# EAGLE schematic Noctua (EAGLE 9.2.1)
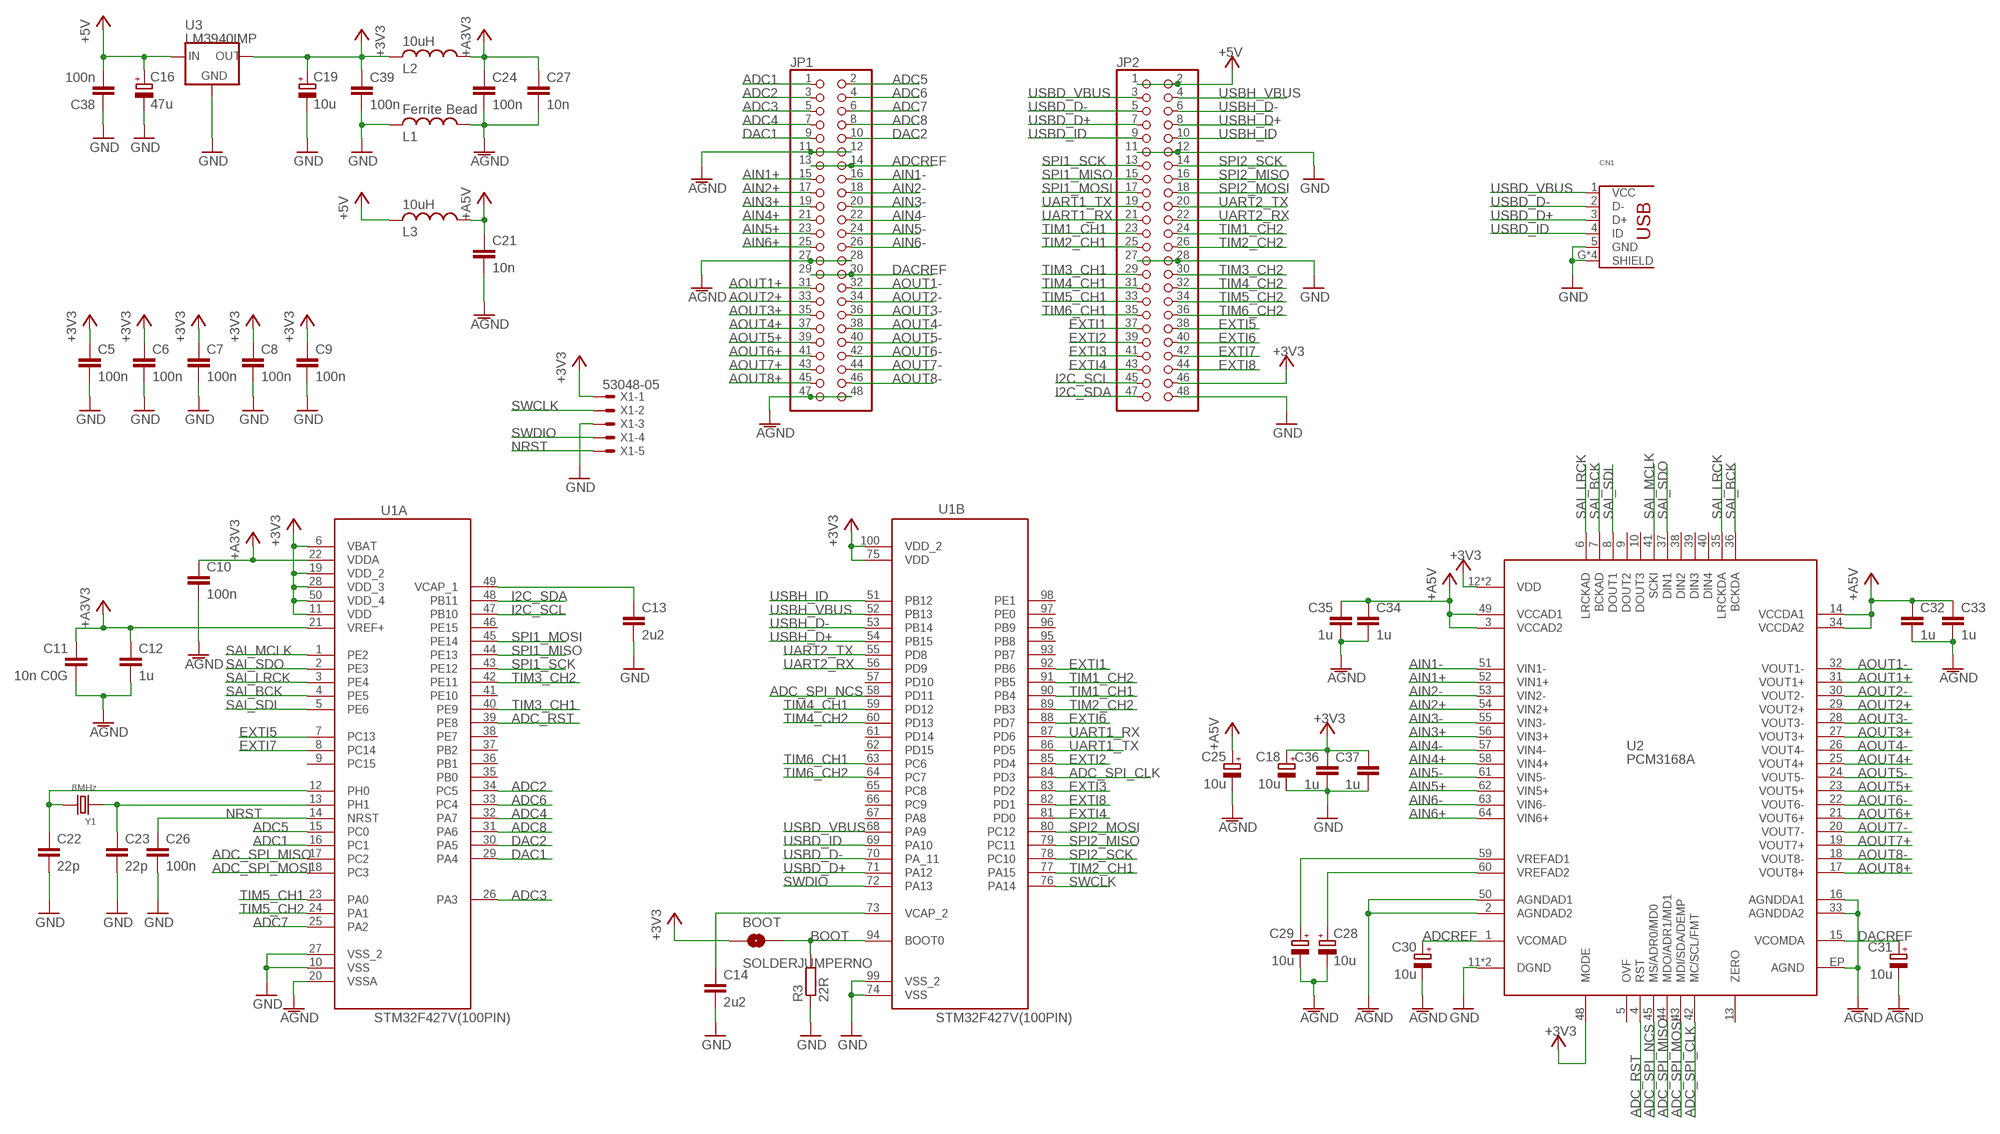
[diagram p0: schematic, sheet 1]

## Parts
BOOT  SOLDERJUMPERNO  [SJ_2S-NO]
C5  100n  C-EUC0603  [C0603]
C6  100n  C-EUC0603  [C0603]
C7  100n  C-EUC0603  [C0603]
C8  100n  C-EUC0603  [C0603]
C9  100n  C-EUC0603  [C0603]
C10  100n  C-EUC0603  [C0603]
C11  10n C0G  C-EUC0603  [C0603]
C12  1u  C-EUC0603  [C0603]
C13  2u2  C-EUC0603  [C0603]
C14  2u2  C-EUC0603  [C0603]
C16  47u  CPOL-EU153CLV-0505  [CPOL-5]
C18  10u  CPOL-EUB  [PANASONIC_B]
C19  10u  CPOL-EUB  [PANASONIC_B]
C21  10n  C-EUC0603  [C0603]
C22  22p  C-EUC0603  [C0603]
C23  22p  C-EUC0603  [C0603]
C24  100n  C-EUC0603  [C0603]
C25  10u  CPOL-EUB  [PANASONIC_B]
C26  100n  C-EUC0603  [C0603]
C27  10n  C-EUC0603  [C0603]
C28  10u  CPOL-EUB  [PANASONIC_B]
C29  10u  CPOL-EUB  [PANASONIC_B]
C30  10u  CPOL-EUB  [PANASONIC_B]
C31  10u  CPOL-EUB  [PANASONIC_B]
C32  1u  C-EUC0603  [C0603]
C33  1u  C-EUC0603  [C0603]
C34  1u  C-EUC0603  [C0603]
C35  1u  C-EUC0603  [C0603]
C36  1u  C-EUC0603  [C0603]
C37  1u  C-EUC0603  [C0603]
C38  100n  C-EUC0603  [C0603]
C39  100n  C-EUC0603  [C0603]
CN1  USB_HRS_ZX62-B-5PA(11)MICRO.B  [HRS_ZX62RD-AB-5P8]
JP1  PINHD-2X24  [2X24]
JP2  PINHD-2X24  [2X24]
L1  Ferrite Bead  INDUCTOR  [0603]
L2  10uH  INDUCTOR  [0603]
L3  10uH  INDUCTOR  [0603]
R3  22R  R-EU_0603  [0603@1]
U1  STM32F427V(100PIN)  STM32F42XV/43XV(100PIN)  [QFP50P1600X1600X160-100N]
U2  PCM3168A  [PQFP64]
U3  LM3940IMP  V_REG_LM3940IMP  [SOT223]
X1  53048-05  [53048-05]
Y1  8MHz  SMD-CRYSTAL-8MHZ-20PF-20PPM(2P-5.0X3.2MM)  [X2-SMD-5.0X3.2X1.3MM]

## Nets
+3V3: BOOT.1 C5.1 C6.1 C7.1 C8.1 C9.1 C18.+ C19.+ C36.1 C37.1 C39.1 JP2.46 L2.2 U1.6(A:VBAT) U1.11(A:VDD) U1.19(A:VDD_2) U1.28(A:VDD_3) U1.50(A:VDD_4) U1.75(B:VDD) U1.100(B:VDD_2) U2.12(VDD) U2.46(VDD) U2.48(MODE) U3.3(OUT) X1.1
+5V: C16.+ C38.2 JP2.1 JP2.2 L3.2 U3.1(IN)
+A3V3: C10.1 C11.1 C12.1 C24.1 C27.1 L2.1 U1.21(A:VREF+) U1.22(A:VDDA)
+A5V: C21.1 C25.+ C32.1 C33.1 C34.1 C35.1 L3.1 U2.3(VCCAD2) U2.14(VCCDA1) U2.34(VCCDA2) U2.49(VCCAD1)
ADC1: JP1.1 U1.16(A:PC1)
ADC2: JP1.3 U1.34(A:PC5)
ADC3: JP1.5 U1.26(A:PA3)
ADC4: JP1.7 U1.32(A:PA7)
ADC5: JP1.2 U1.15(A:PC0)
ADC6: JP1.4 U1.33(A:PC4)
ADC7: JP1.6 U1.25(A:PA2)
ADC8: JP1.8 U1.31(A:PA6)
ADC_RST: U1.39(A:PE8) U2.4(RST)
ADC_SPI_CLK: U1.84(B:PD3) U2.42(MC/SCL/FMT)
ADC_SPI_MISO: U1.17(A:PC2) U2.44(MDO/ADR1/MD1)
ADC_SPI_MOSI: U1.18(A:PC3) U2.43(MDI/SDA/DEMP)
ADC_SPI_NCS: U1.58(B:PD11) U2.45(MS/ADR0/MD0)
ADCREF: C30.+ JP1.13 JP1.14 U2.1(VCOMAD)
AGND: C10.2 C11.2 C12.2 C21.2 C24.2 C25.- C27.2 C28.- C29.- C30.- C31.- C32.2 C33.2 C34.2 C35.2 JP1.11 JP1.12 JP1.27 JP1.28 JP1.47 JP1.48 L1.1 U1.20(A:VSSA) U2.2(AGNDAD2) U2.16(AGNDDA1) U2.33(AGNDDA2) U2.50(AGNDAD1) U2.EP(AGND)
AIN1+: JP1.15 U2.52(VIN1+)
AIN1-: JP1.16 U2.51(VIN1-)
AIN2+: JP1.17 U2.54(VIN2+)
AIN2-: JP1.18 U2.53(VIN2-)
AIN3+: JP1.19 U2.56(VIN3+)
AIN3-: JP1.20 U2.55(VIN3-)
AIN4+: JP1.21 U2.58(VIN4+)
AIN4-: JP1.22 U2.57(VIN4-)
AIN5+: JP1.23 U2.62(VIN5+)
AIN5-: JP1.24 U2.61(VIN5-)
AIN6+: JP1.25 U2.64(VIN6+)
AIN6-: JP1.26 U2.63(VIN6-)
AOUT1+: JP1.31 U2.31(VOUT1+)
AOUT1-: JP1.32 U2.32(VOUT1-)
AOUT2+: JP1.33 U2.29(VOUT2+)
AOUT2-: JP1.34 U2.30(VOUT2-)
AOUT3+: JP1.35 U2.27(VOUT3+)
AOUT3-: JP1.36 U2.28(VOUT3-)
AOUT4+: JP1.37 U2.25(VOUT4+)
AOUT4-: JP1.38 U2.26(VOUT4-)
AOUT5+: JP1.39 U2.23(VOUT5+)
AOUT5-: JP1.40 U2.24(VOUT5-)
AOUT6+: JP1.41 U2.21(VOUT6+)
AOUT6-: JP1.42 U2.22(VOUT6-)
AOUT7+: JP1.43 U2.19(VOUT7+)
AOUT7-: JP1.44 U2.20(VOUT7-)
AOUT8+: JP1.45 U2.17(VOUT8+)
AOUT8-: JP1.46 U2.18(VOUT8-)
BOOT: BOOT.2 R3.2 U1.94(B:BOOT0)
DAC1: JP1.9 U1.29(A:PA4)
DAC2: JP1.10 U1.30(A:PA5)
DACREF: C31.+ JP1.29 JP1.30 U2.15(VCOMDA)
EXTI1: JP2.37 U1.92(B:PB6)
EXTI2: JP2.39 U1.85(B:PD4)
EXTI3: JP2.41 U1.83(B:PD2)
EXTI4: JP2.43 U1.81(B:PD0)
EXTI5: JP2.38 U1.7(A:PC13)
EXTI6: JP2.40 U1.88(B:PD7)
EXTI7: JP2.42 U1.8(A:PC14)
EXTI8: JP2.44 U1.82(B:PD1)
GND: C5.2 C6.2 C7.2 C8.2 C9.2 C13.2 C14.2 C16.- C18.- C19.- C22.2 C23.2 C26.2 C36.2 C37.2 C38.1 C39.2 CN1.5(GND) CN1.G2(SHIELD) CN1.G3(SHIELD) CN1.G4(SHIELD) CN1.G(SHIELD) JP2.11 JP2.12 JP2.27 JP2.28 JP2.48 L1.2 R3.1 U1.10(A:VSS) U1.27(A:VSS_2) U1.74(B:VSS) U1.99(B:VSS_2) U2.11(DGND) U2.47(DGND) U3.2(GND) X1.3
I2C_SCL: JP2.45 U1.47(A:PB10)
I2C_SDA: JP2.47 U1.48(A:PB11)
N$2: C28.+ U2.60(VREFAD2)
N$11: C13.1 U1.49(A:VCAP_1)
N$12: C23.1 U1.13(A:PH1) Y1.1
N$15: C22.1 U1.12(A:PH0) Y1.2
N$17: C14.1 U1.73(B:VCAP_2)
NRST: C26.1 U1.14(A:NRST) X1.5
SAI_BCK: U1.4(A:PE5) U2.7(BCKAD) U2.36(BCKDA)
SAI_LRCK: U1.3(A:PE4) U2.6(LRCKAD) U2.35(LRCKDA)
SAI_MCLK: U1.1(A:PE2) U2.41(SCKI)
SAI_SDI: U1.5(A:PE6) U2.8(DOUT1)
SAI_SDO: U1.2(A:PE3) U2.37(DIN1)
SPI1_MISO: JP2.15 U1.44(A:PE13)
SPI1_MOSI: JP2.17 U1.45(A:PE14)
SPI1_SCK: JP2.13 U1.43(A:PE12)
SPI2_MISO: JP2.16 U1.79(B:PC11)
SPI2_MOSI: JP2.18 U1.80(B:PC12)
SPI2_SCK: JP2.14 U1.78(B:PC10)
SWCLK: U1.76(B:PA14) X1.2
SWDIO: U1.72(B:PA13) X1.4
TIM1_CH1: JP2.23 U1.90(B:PB4)
TIM1_CH2: JP2.24 U1.91(B:PB5)
TIM2_CH1: JP2.25 U1.77(B:PA15)
TIM2_CH2: JP2.26 U1.89(B:PB3)
TIM3_CH1: JP2.29 U1.40(A:PE9)
TIM3_CH2: JP2.30 U1.42(A:PE11)
TIM4_CH1: JP2.31 U1.59(B:PD12)
TIM4_CH2: JP2.32 U1.60(B:PD13)
TIM5_CH1: JP2.33 U1.23(A:PA0)
TIM5_CH2: JP2.34 U1.24(A:PA1)
TIM6_CH1: JP2.35 U1.63(B:PC6)
TIM6_CH2: JP2.36 U1.64(B:PC7)
UART1_RX: JP2.21 U1.87(B:PD6)
UART1_TX: JP2.19 U1.86(B:PD5)
UART2_RX: JP2.22 U1.56(B:PD9)
UART2_TX: JP2.20 U1.55(B:PD8)
USBD_D+: CN1.3(D+) JP2.7 U1.71(B:PA12)
USBD_D-: CN1.2(D-) JP2.5 U1.70(B:PA_11)
USBD_ID: CN1.4(ID) JP2.9 U1.69(B:PA10)
USBD_VBUS: CN1.1(VCC) JP2.3 U1.68(B:PA9)
USBH_D+: JP2.8 U1.54(B:PB15)
USBH_D-: JP2.6 U1.53(B:PB14)
USBH_ID: JP2.10 U1.51(B:PB12)
USBH_VBUS: JP2.4 U1.52(B:PB13)
VREF_ADC: C29.+ U2.59(VREFAD1)
Unconnected: U1.9(A:PC15) U1.35(A:PB0) U1.36(A:PB1) U1.37(A:PB2) U1.38(A:PE7) U1.41(A:PE10) U1.46(A:PE15) U1.57(B:PD10) U1.61(B:PD14) U1.62(B:PD15) U1.65(B:PC8) U1.66(B:PC9) U1.67(B:PA8) U1.93(B:PB7) U1.95(B:PB8) U1.96(B:PB9) U1.97(B:PE0) U1.98(B:PE1) U2.5(OVF) U2.9(DOUT2) U2.10(DOUT3) U2.13(ZERO) U2.38(DIN2) U2.39(DIN3) U2.40(DIN4)

## Library data of the parts
BOOT = SparkFun:SOLDERJUMPER: Solder Jumper Standard SMD solder jumper. Used to automate production. Two varients : Normally Open and Normally Closed are the same, but have different paste layers. NC will have a large amount of paste and should jumper during reflow.
C5-C14 C21-C24 C26 C27 C32-C39 = Rebel:C-EU: CAPACITOR, European symbol
C16 C18 C19 C25 C28-C31 = Rebel:CPOL-EU: POLARIZED CAPACITOR, European symbol
CN1 = Rebel:USB_HRS_ZX62-B-5PA(11)MICRO.B
JP1 JP2 = pinhead:PINHD-2X24: PIN HEADER
L1-L3 = Rebel:INDUCTOR; OC_FARNELL: 2288736
R3 = Rebel:R-EU_: RESISTOR, European symbol
U1 = Rebel:STM32F42XV/43XV(100PIN): STM32F746VGT6
U2 = Rebel:PCM3168A
U3 = James:V_REG_LM3940IMP: LM3940IMP Fixed LDO Voltage Regulator Farnell: 1469104; OC_FARNELL: 1469104
X1 = con-molex:53?-05: CONNECTOR wire to board 1.25 mm (.049 inch) pitch header; MF: MOLEX; MPN: 53048-0510; OC_FARNELL: 9732926; OC_NEWARK: 57H4722
Y1 = Seeed-OPL-crystal-osctllator:SMD-CRYSTAL-8MHZ-20PF-20PPM(2P-5.0X3.2MM): 306010004; MPN: 5032/2P; VALUE: 5032/2p

## Net classes
1 power: width 0.178 mm, drill 0.305 mm, clearance 0.178 mm to class 0, clearance 0.178 mm